# EAGLE schematic SensorBoard (EAGLE 9.4.0)
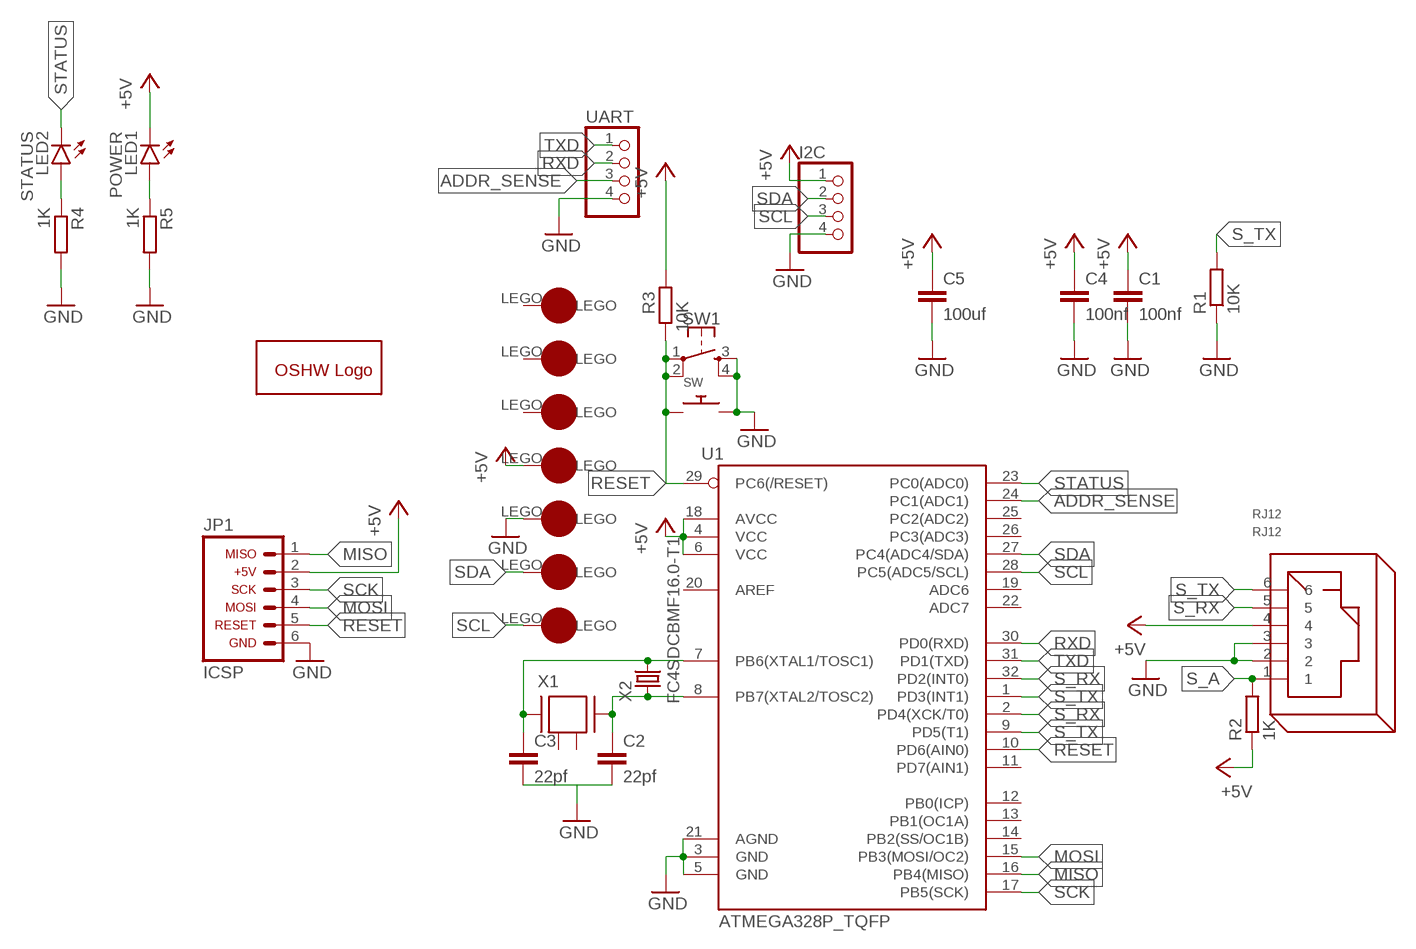
[diagram p0: schematic, sheet 1]

## Parts
C1  100nf  C-EUC1206  [C1206]
C2  22pf  C-EUC1206  [C1206]
C3  22pf  C-EUC1206  [C1206]
C4  100nf  C-EUC1206  [C1206]
C5  100uf  C-EUC1206  [C1206]
I2C  PINHD-1X4  [1X04]
JP1  ICSP_HEADER  [ICSP_HEADER]
LED1  POWER  LEDSMT1206  [1206]
LED2  STATUS  LEDSMT1206  [1206]
R1  10K  R-EU_M1206  [M1206]
R2  1K  R-EU_M1206  [M1206]
R3  10K  R-EU_M1206  [M1206]
R4  1K  R-EU_M1206  [M1206]
R5  1K  R-EU_M1206  [M1206]
RJ12  RJ12  [RJ12]
SW  SWITCH_PUSHBUTTONC&K_KSS  [BTN_CK_KSS]
SW1  MOMENTARY-SWITCH-SPST-2-SMD-5.2MM  [TACTILE_SWITCH_SMD_5.2MM]
U1  ATMEGA328P_TQFP  [TQFP32-08]
U$1  LEGO-1X1  [LEGO-1X1]
U$2  OPENSOURCE  [OSHW_5MM]
U$3  LEGO-1X1  [LEGO-1X1]
U$4  LEGO-1X1  [LEGO-1X1]
U$5  LEGO-1X1  [LEGO-1X1]
U$6  LEGO-1X1  [LEGO-1X1]
U$7  LEGO-1X1  [LEGO-1X1]
U$9  LEGO-1X1  [LEGO-1X1]
UART  PINHD-1X4  [1X04]
X1  7B-16.000MAAJ-T  [7B-16.000MAAJ-T]
X2  FC4SDCBMF16.0-T1  [FC4SDCBMF16.0-T1]

## Nets
+5V: C1.1 C4.1 C5.1 I2C.1 JP1.2 LED1.C R2.1 R3.2 RJ12.4 U1.4(VCC) U1.6(VCC) U1.18(AVCC) U$5.LEGO
ADDR_SENSE: U1.24(PC1(ADC1)) UART.3
GND: C1.2 C2.2 C3.2 C4.2 C5.2 I2C.4 JP1.6 R1.1 R4.2 R5.2 RJ12.2 RJ12.3 SW1.3 SW1.4 SW.P$2 U1.3(GND) U1.5(GND) U1.21(AGND) U$4.LEGO UART.4
MISO: JP1.1 U1.16(PB4(MISO))
MOSI: JP1.4 U1.15(PB3(MOSI/OC2))
N$1: C2.1 U1.8(PB7(XTAL2/TOSC2)) X1.3 X2.1
N$2: C3.1 U1.7(PB6(XTAL1/TOSC1)) X1.1 X2.2
N$3: LED2.A R4.1
N$4: LED1.A R5.1
RESET: JP1.5 R3.1 SW1.1 SW1.2 SW.P$1 U1.10(PD6(AIN0)) U1.29(PC6(/RESET))
RXD: U1.30(PD0(RXD)) UART.2
S_A: R2.2 RJ12.1
S_RX: RJ12.5 U1.2(PD4(XCK/T0)) U1.32(PD2(INT0))
S_TX: R1.2 RJ12.6 U1.1(PD3(INT1)) U1.9(PD5(T1))
SCK: JP1.3 U1.17(PB5(SCK))
SCL: I2C.3 U1.28(PC5(ADC5/SCL)) U$1.LEGO
SDA: I2C.2 U1.27(PC4(ADC4/SDA)) U$3.LEGO
STATUS: LED2.C U1.23(PC0(ADC0))
TXD: U1.31(PD1(TXD)) UART.1
Unconnected: U1.11(PD7(AIN1)) U1.12(PB0(ICP)) U1.13(PB1(OC1A)) U1.14(PB2(SS/OC1B)) U1.19(ADC6) U1.20(AREF) U1.22(ADC7) U1.25(PC2(ADC2)) U1.26(PC3(ADC3)) U$6.LEGO U$7.LEGO U$9.LEGO X1.2 X1.4

## Library data of the parts
C1-C5 = rcl:C-EU: CAPACITOR, European symbol; SPICEPREFIX: C
I2C UART = pinhead:PINHD-1X4: PIN HEADER
JP1 = Cing Library:ICSP_HEADER: Arduino ICSP I/O Header This is the ICSP I/O header on the Arduino Uno R3. This connector is labeled with the following pin assignments: MISO +5V SCK MOSI RESET GND NOTE: Be sure you install this connector with the correct orientation on your PCB layout. Pin 1 has a square pad to assist with orientation.
LED1 LED2 = led:LED: LED OSRAM: - CHIPLED LG R971, LG N971, LY N971, LG Q971, LY Q971, LO R971, LY R971 LH N974, LH R974 LS Q976, LO Q976, LY Q976 LO Q996 - Hyper CHIPLED LW Q18S LB Q993, LB Q99A, LB R99A - SideLED LS A670, LO A670, LY A670, LG A670, LP A670 LB A673, LV A673, LT A673, LW A673 LH A674 LY A675 LS A676, LA A676, LO A676, LY A676, LW A676 LS A679, LY A679, LG A679 - Hyper Micro SIDELED® LS Y876, LA Y876, LO Y876, LY Y876 LT Y87S - SmartLED LW L88C, LW L88S LB L89C, LB L89S, LG L890 LS L89K, LO L89K, LY L89K LS L896, LA L896, LO L896, LY L896 - TOPLED LS T670, LO T670, LY T670, LG T670, LP T670 LSG T670, LSP T670, LSY T670, LOP T670, LYG T670 LG T671, LOG T671, LSG T671 LB T673, LV T673, LT T673, LW T673 LH T674 LS T676, LA T676, LO T676, LY T676, LB T676, LH T676, LSB T676, LW T676 LB T67C, LV T67C, LT T67C, LS T67K, LO T67K, LY T67K, LW E67C LS E67B, LA E67B, LO E67B, LY E67B, LB E67C, LV E67C, LT E67C LW T67C LS T679, LY T679, LG T679 LS T770, LO T770, LY T770, LG T770, LP T770 LB T773, LV T773, LT T773, LW T773 LH T774 LS E675, LA E675, LY E675, LS T675 LS T776, LA T776, LO T776, LY T776, LB T776 LHGB T686 LT T68C, LB T68C - Hyper Mini TOPLED® LB M676 - Mini TOPLED Santana® LG M470 LS M47K, LO M47K, LY M47K Source: http://www.osram.convergy.de LUXEON: - LUMILED® LXK2-PW12-R00, LXK2-PW12-S00, LXK2-PW14-U00, LXK2-PW14-V00 LXK2-PM12-R00, LXK2-PM12-S00, LXK2-PM14-U00 LXK2-PE12-Q00, LXK2-PE12-R00, LXK2-PE12-S00, LXK2-PE14-T00, LXK2-PE14-U00 LXK2-PB12-K00, LXK2-PB12-L00, LXK2-PB12-M00, LXK2-PB14-N00, LXK2-PB14-P00, LXK2-PB14-Q00 LXK2-PR12-L00, LXK2-PR12-M00, LXK2-PR14-Q00, LXK2-PR14-R00 LXK2-PD12-Q00, LXK2-PD12-R00, LXK2-PD12-S00 LXK2-PH12-R00, LXK2-PH12-S00 LXK2-PL12-P00, LXK2-PL12-Q00, LXK2-PL12-R00 Source: www.luxeon.com KINGBRIGHT: KA-3528ASYC Source: www.kingbright.com
R1-R5 = rcl:R-EU_: RESISTOR, European symbol; SPICEPREFIX: R
RJ12 = con-rj:RJ12: RJ12, RJ14 and RJ25 RJ12, RJ14 and RJ25 jacks side mounted http://www.tycoelectronics.com
SW = adafruit:SWITCH_PUSHBUTTON: Buttons SOFTTOUCHSMD_SJ - Soft touch temporary push button (Super Junk Akihabara) Compatible with SKPMANE010 [Mouser: 688-SKPMAN] C&K_KSS = Digikey: KSS221GLFS
SW1 = SparkFun-Switches:MOMENTARY-SWITCH-SPST-2: Momentary Switch (Pushbutton) - SPST - Two Circuits Normally-open (NO) SPST momentary switches (buttons, pushbuttons). Schematic symbol includes two switch circuits. Variants SMD-4.6MMX2.8MM - 4.60mm x 2.80mm Tactile Momentary Button Switch - Used on SparkFun SAMD21 Mini Breakout <https://www.sparkfun.com/products/13664> SMD-5.2MM - Mini Pushbutton Switch - SMD <https://www.sparkfun.com/products/8720> - Used on Arduino Pro Mini <https://www.sparkfun.com/products/11114>; PROD_ID: SWCH-08247; SF_SKU: COM-08720
U1 = SparkFun-IC-Microcontroller:ATMEGA328P_TQFP: Popular 328P in QFP Storefront component: ATmega328 - TQFP <https://www.sparkfun.com/products/13448> (COM-13448) Datasheet <http://www.sparkfun.com/datasheets/Components/SMD/ATMega328.pdf> SparkFun Products SparkFun RedBoard - Programmed with Arduino <https://www.sparkfun.com/products/12757> (DEV-12757) Arduino Pro Mini 328 - 5V/16MHz <https://www.sparkfun.com/products/11113> (DEV-11113) Arduino Pro Mini 328 - 3.3V/8MHz <https://www.sparkfun.com/products/11114> (DEV-11114) SparkFun OpenLog <https://www.sparkfun.com/products/13712> (DEV-13712) SparkFun MicroView - OLED Arduino Module <https://www.sparkfun.com/products/12923> (DEV-12923) SparkFun Digital Sandbox <https://www.sparkfun.com/products/12651> (DEV-12651) SparkFun PicoBoard <https://www.sparkfun.com/products/11888> (WIG-11888) Arduino Fio <https://www.sparkfun.com/products/10116> (DEV-10116) LilyPad Arduino 328 Main Board <https://www.sparkfun.com/products/13342> (DEV-13342) SparkFun RedStick <https://www.sparkfun.com/products/13741> (DEV-13741) LilyPad MP3 <https://www.sparkfun.com/products/11013> (DEV-11013) LilyPad Arduino SimpleSnap <https://www.sparkfun.com/products/10941> (DEV-10941) SparkFun Stepoko <https://www.sparkfun.com/products/13899> (ROB-13899) SparkFun Geiger Counter <https://www.sparkfun.com/products/11345> (SEN-11345) SparkFun EL Sequencer <https://www.sparkfun.com/products/12781> (COM-12781) Arduino Pro 328 - 5V/16MHz <https://www.sparkfun.com/products/10915> (DEV-10915) CryptoCape <https://www.sparkfun.com/products/12773> (DEV-12773) SparkFun IR Thermometer Evaluation Board - MLX90614 <https://www.sparkfun.com/products/10740> (SEN-10740) SparkFun RedBot Mainboard <https://www.sparkfun.com/products/12097> (ROB-12097) Arduino Pro 328 - 3.3V/8MHz <https://www.sparkfun.com/products/10914> (DEV-10914) SparkFun Block for Intel® Edison - Arduino <https://www.sparkfun.com/products/13036> (DEV-13036) SparkFun Simon Says - Surface Mount Soldering Kit <https://www.sparkfun.com/products/10935> (KIT-10935) SparkFun 7-Segment Serial Display - Red <https://www.sparkfun.com/products/11441> (COM-11441) SparkFun 7-Segment Serial Display - White <https://www.sparkfun.com/products/11629> (COM-11629) SparkFun 7-Segment Serial Display - Yellow <https://www.sparkfun.com/products/11443> (COM-11443) SparkFun 7-Segment Serial Display - Kelly Green <https://www.sparkfun.com/products/11440> (COM-11440) SparkFun 7-Segment Serial Display - Blue <https://www.sparkfun.com/products/11442> (COM-11442) SparkFun OpenSegment Serial Display - 20mm (Blue) <https://www.sparkfun.com/products/11647> (COM-11647) SparkFun OpenSegment Serial Display - 20mm (Green) <https://www.sparkfun.com/products/11646> (COM-11646) SparkFun OpenSegment Serial Display - 20mm (White) <https://www.sparkfun.com/products/11648> (COM-11648) SparkFun OpenSegment Serial Display - 20mm (Red) <https://www.sparkfun.com/products/11644> (COM-11644) SparkFun OpenSegment Serial Display - 20mm (Yellow) <https://www.sparkfun.com/products/11645> (COM-11645) SparkFun OpenSegment Shield <https://www.sparkfun.com/products/13190> (DEV-13190); PROD_ID: IC-09069
U$1 U$3-U$7 U$9 = Cing Library:LEGO-1X1
U$2 = Cing Library:OPENSOURCE
X1 = Crystals:7B-16.000MAAJ-T: CRYSTAL 16.0000MHZ 18PF SMD Manufacturer's datasheet <http://www.txccorp.com/download/products/quartz_crystals/2015TXC_7B_19.pdf>; CRAETED_BY: PCBLayout.com; DIGIKEY_PART_NUMBER: 887-1104-2-ND; MANUFACTURER: TXC CORPORATION; MPN: 7B-16.000MAAJ-T; PACKAGE: SMD 4
X2 = Crystals:FC4SDCBMF16.0-T1: CRYSTAL 16.0000MHZ 20PF SMD Manufacturer's datasheet <https://www.foxonline.com/wp-content/uploads/pdfs/C4SD.pdf>; CREATED_BY: PCBLayout.com; DIGIKEY_PART_NUMBER: 631-1017-2-ND; MANUFACTURER: Fox Electronics; MPN: FC4SDCBMF16.0-T1; PACKAGE: SMD